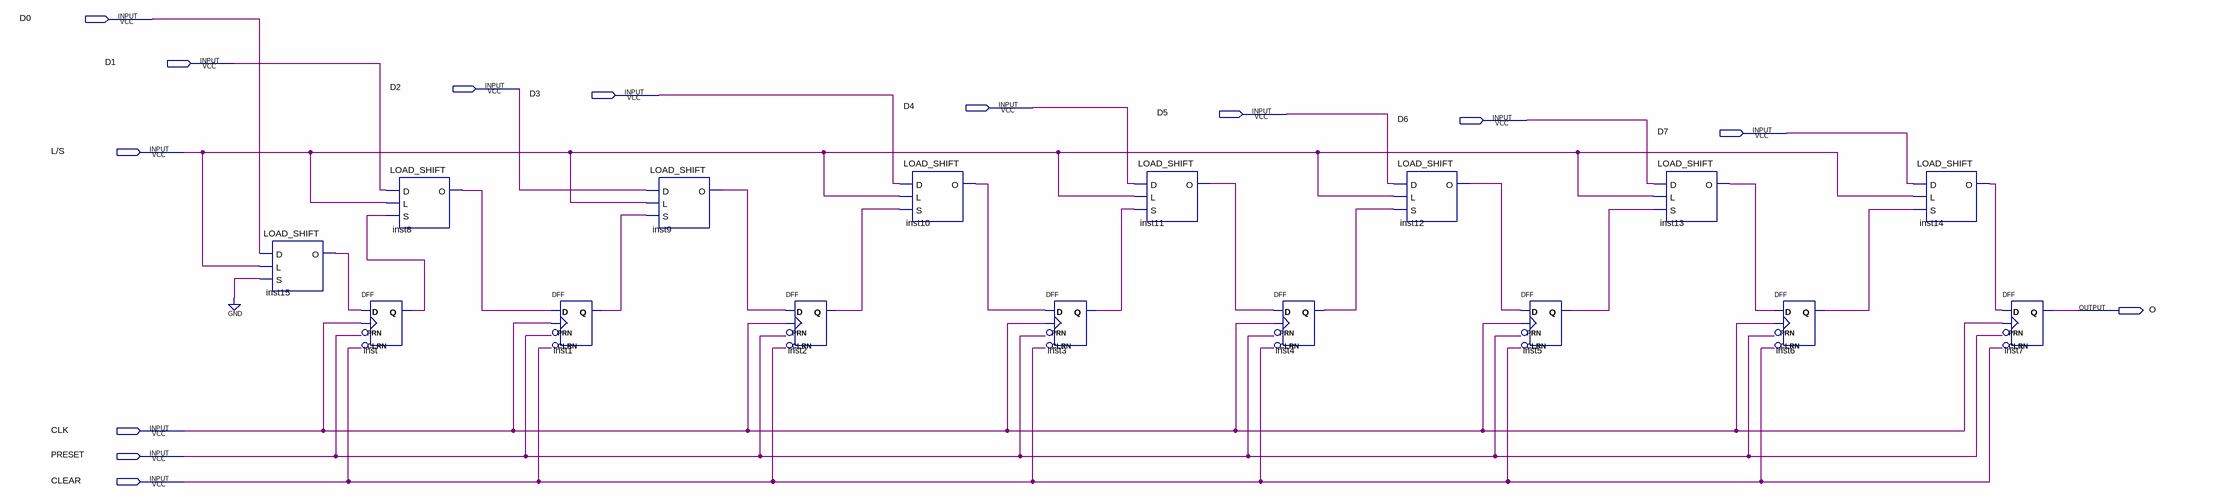
[diagram p0: schematic sheet]
// Quartus schematic PISO8Bits.bdf as structural Verilog: 16 symbols, 13 pins
module PISO8Bits (
  input  D0,
  input  D1,
  input  D2,
  input  D3,
  input  D4,
  input  D5,
  input  D6,
  input  D7,
  input  \L/S ,
  input  CLK,
  input  PRESET,
  input  CLEAR,
  output O
);

  wire inst1_q, inst2_q, inst3_q, inst4_q, inst5_q, inst6_q, inst8_o, inst9_o, inst10_o, inst11_o, inst12_o,
       inst13_o, inst14_o, inst15_o, inst_q;

  LOAD_SHIFT inst15 (.D(D0), .L(\L/S ), .S(1'b0), .O(inst15_o));
  LOAD_SHIFT inst8 (.D(D1), .L(\L/S ), .S(inst_q), .O(inst8_o));
  DFF inst (.CLRN(CLEAR), .CLK(CLK), .D(inst15_o), .PRN(PRESET), .Q(inst_q));
  DFF inst1 (.CLRN(CLEAR), .CLK(CLK), .D(inst8_o), .PRN(PRESET), .Q(inst1_q));
  LOAD_SHIFT inst9 (.D(D2), .L(\L/S ), .S(inst1_q), .O(inst9_o));
  DFF inst2 (.CLRN(CLEAR), .CLK(CLK), .D(inst9_o), .PRN(PRESET), .Q(inst2_q));
  LOAD_SHIFT inst10 (.D(D3), .L(\L/S ), .S(inst2_q), .O(inst10_o));
  DFF inst3 (.CLRN(CLEAR), .CLK(CLK), .D(inst10_o), .PRN(PRESET), .Q(inst3_q));
  LOAD_SHIFT inst11 (.D(D4), .L(\L/S ), .S(inst3_q), .O(inst11_o));
  DFF inst4 (.CLRN(CLEAR), .CLK(CLK), .D(inst11_o), .PRN(PRESET), .Q(inst4_q));
  LOAD_SHIFT inst12 (.D(D5), .L(\L/S ), .S(inst4_q), .O(inst12_o));
  DFF inst5 (.CLRN(CLEAR), .CLK(CLK), .D(inst12_o), .PRN(PRESET), .Q(inst5_q));
  LOAD_SHIFT inst13 (.D(D6), .L(\L/S ), .S(inst5_q), .O(inst13_o));
  DFF inst6 (.CLRN(CLEAR), .CLK(CLK), .D(inst13_o), .PRN(PRESET), .Q(inst6_q));
  LOAD_SHIFT inst14 (.D(D7), .L(\L/S ), .S(inst6_q), .O(inst14_o));
  DFF inst7 (.CLRN(CLEAR), .CLK(CLK), .D(inst14_o), .PRN(PRESET), .Q(O));
endmodule
